# Altium schematic sheet izolator.SchDoc
size A4
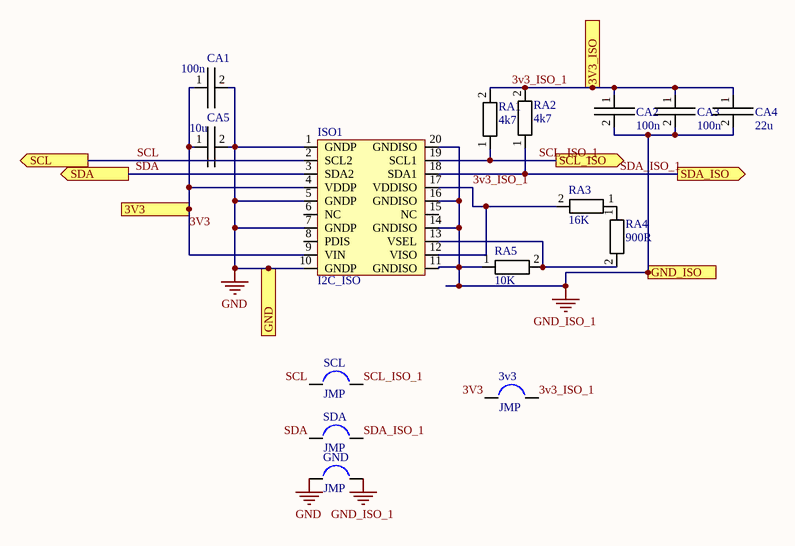
[diagram p0: izolator.SchDoc]

## Parts
3v3  JMP  [JMP]
CA1  100n  [Capacitor]
CA2  100n  [Capacitor]
CA3  100n  [Capacitor]
CA4  22u  [Capacitor]
CA5  10u  [Capacitor]
GND  JMP  [JMP]
ISO1  I2C_ISO  [SOP65P780X200-20N]
RA1  4k7  [Resistor]
RA2  4k7  [Resistor]
RA3  16K  [Resistor]
RA4  900R  [Resistor]
RA5  10K  [Resistor]
SCL  JMP  [JMP]
SDA  JMP  [JMP]

## Ports
3V3 (out), 3V3_ISO (out), GND (out), GND_ISO (out), SCL (out), SCL_ISO (out), SDA (out), SDA_ISO (out)

## Nets
GND: CA1.2 CA5.2 GND.1 ISO1.1(GNDP) ISO1.5(GNDP) ISO1.7(GNDP) ISO1.10(GNDP) ; port GND
GND_ISO_1: CA2.2 CA3.2 CA4.2 GND.2 ISO1.11(GNDISO) ISO1.14(GNDISO) ISO1.16(GNDISO) ISO1.20(GNDISO) RA5.1 ; port GND_ISO
3V3: 3v3.1 CA1.1 CA5.1 ISO1.4(VDDP) ISO1.9(VIN) ; port 3V3
3v3_ISO_1: 3v3.2 CA2.1 CA3.1 CA4.1 ISO1.12(VISO) ISO1.17(VDDISO) RA1.2 RA2.2 RA3.2 ; port 3V3_ISO
SCL: ISO1.2(SCL2) SCL.1 ; port SCL
SCL_ISO_1: ISO1.19(SCL1) RA1.1 SCL.2 ; port SCL_ISO
SDA: ISO1.3(SDA2) SDA.1 ; port SDA
SDA_ISO_1: ISO1.18(SDA1) RA2.1 SDA.2 ; port SDA_ISO
NetISO1_13: ISO1.13(VSEL) RA4.2 RA5.2
NetRA3_1: RA3.1 RA4.1

Not connected (* = marked no-connect by the designer): ISO1 6(NC) 8(PDIS) 15(NC)

## Library data of the parts
CA1-CA5 = Cap: Capacitor
ISO1 = I2C_ISO: ADM3260_mouser
RA1-RA5 = Resistor